# EAGLE design ultrasonic (EAGLE 9.3.2)
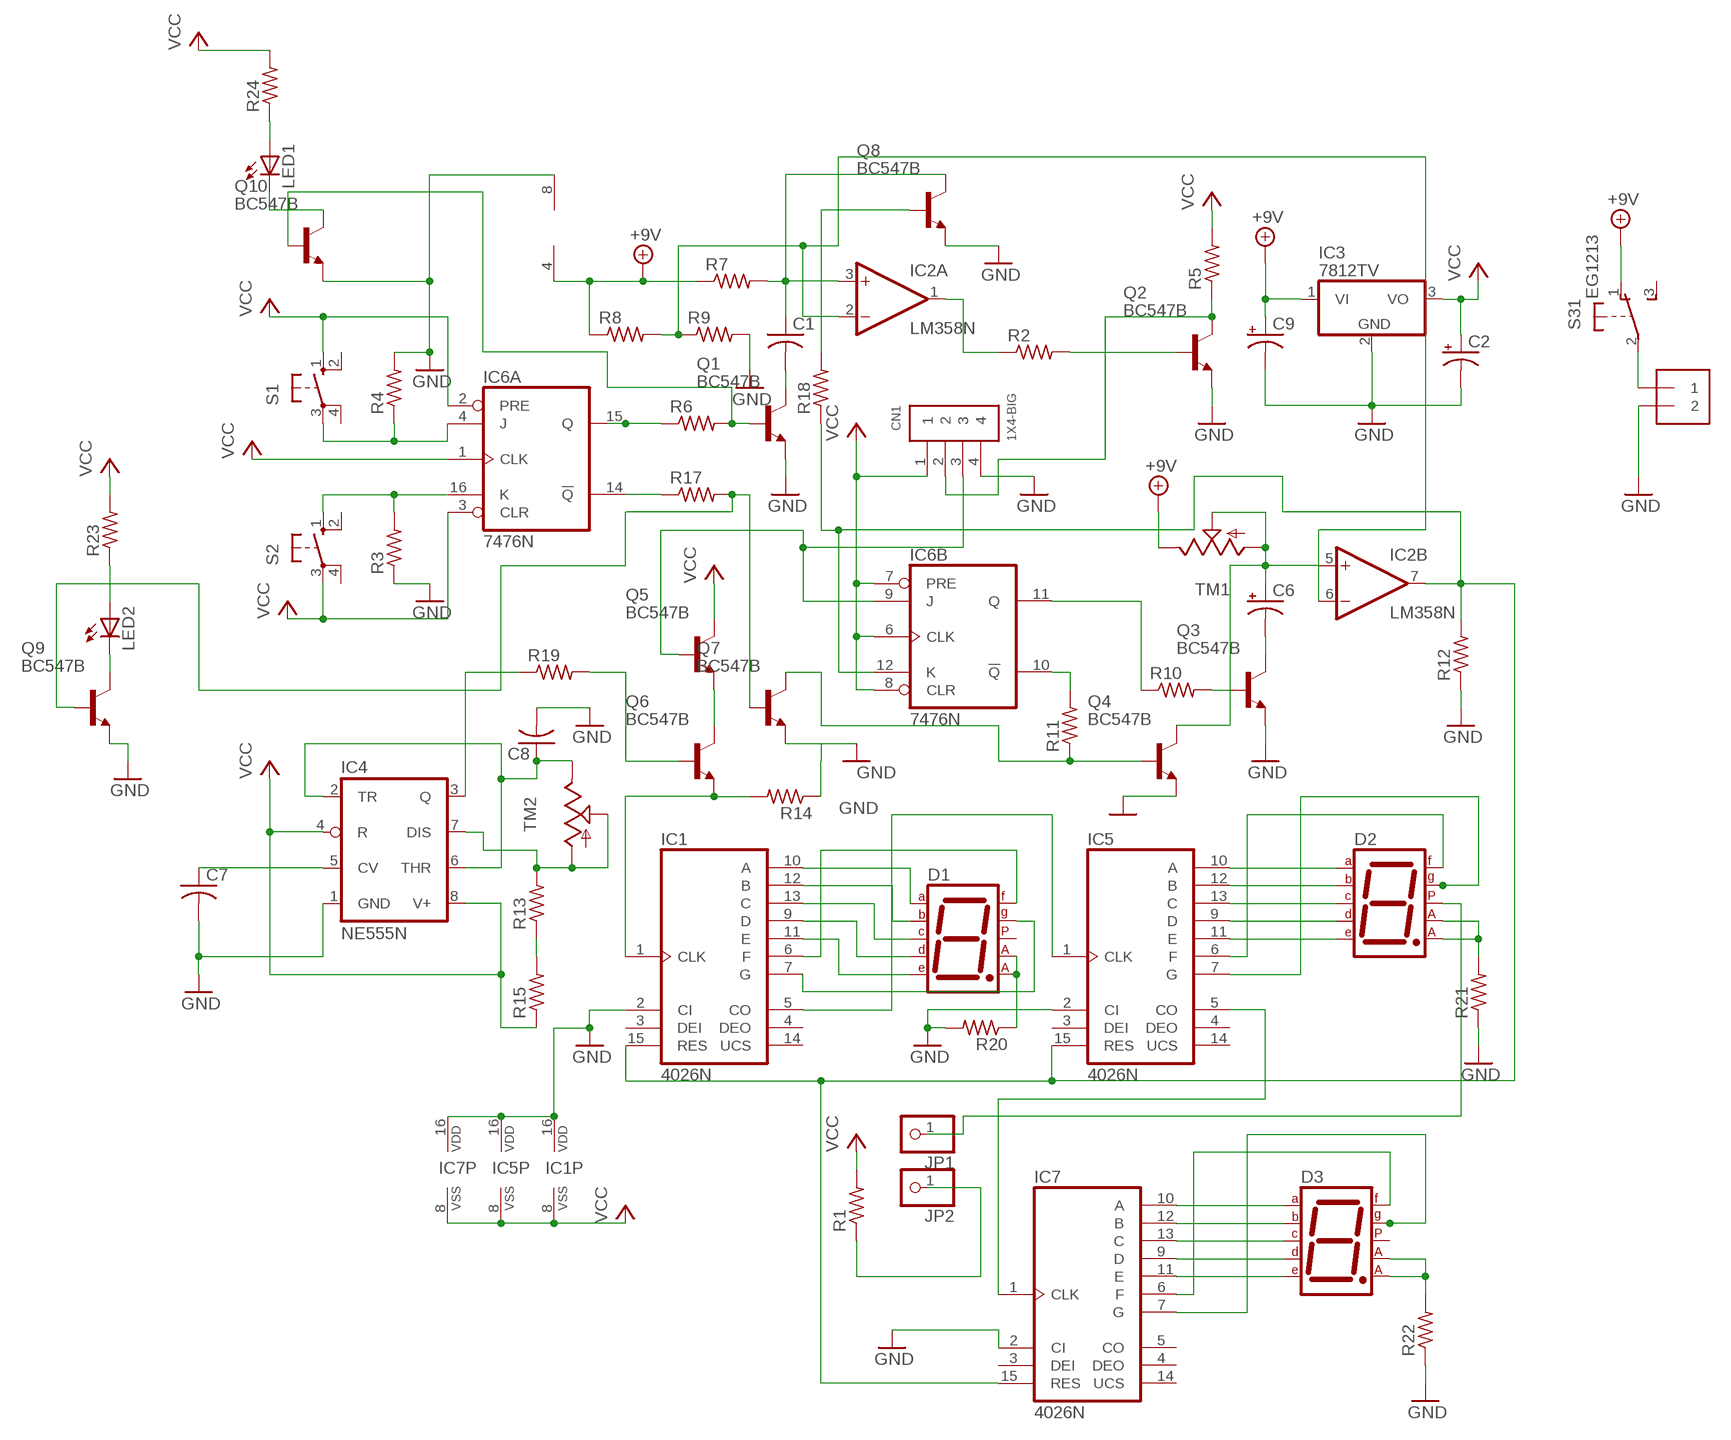
[diagram p0: schematic, sheet 1]

## Parts
C1  C-US025-040X050  [C025-040X050]
C2  CPOL-USE2-4  [E2-4]
C6  CPOL-USE2.5-6  [E2,5-6]
C7  C-US025-040X050  [C025-040X050]
C8  C-US025-040X050  [C025-040X050]
C9  CPOL-USE2.5-6  [E2,5-6]
CN1  1X4-BIG  [1X04-BIG]
D1  7SEG-CA  [7SEG-13]
D2  7SEG-CA  [7SEG-13]
D3  7SEG-CA  [7SEG-13]
IC1  4026N  [DIL16]
IC2  LM358N  [DIL08]
IC3  7812TV  [TO220V]
IC4  NE555N  [DIL08-ROUND]
IC5  4026N  [DIL16]
IC6  7476N  [DIL16]
IC7  4026N  [DIL16]
J1  1X2-3.5MM  [1X2-3.5MM]
JP1  PINHD-1X1  [1X01]
JP2  PINHD-1X1  [1X01]
LED1  LED5MM  [LED5MM]
LED2  LED5MM  [LED5MM]
Q1  BC547B  [TO92]
Q2  BC547B  [TO92]
Q3  BC547B  [TO92]
Q4  BC547B  [TO92]
Q5  BC547B  [TO92]
Q6  BC547B  [TO92]
Q7  BC547B  [TO92]
Q8  BC547B  [TO92]
Q9  BC547B  [TO92]
Q10  BC547B  [TO92]
R1  R-US_0204/7  [0204/7]
R2  R-US_0204/7  [0204/7]
R3  R-US_0204/7  [0204/7]
R4  R-US_0204/7  [0204/7]
R5  R-US_0204/7  [0204/7]
R6  R-US_0204/7  [0204/7]
R7  R-US_0204/7  [0204/7]
R8  R-US_0204/7  [0204/7]
R9  R-US_0204/7  [0204/7]
R10  R-US_0204/7  [0204/7]
R11  R-US_0204/7  [0204/7]
R12  R-US_0204/7  [0204/7]
R13  R-US_0204/7  [0204/7]
R14  R-US_0204/7  [0204/7]
R15  R-US_0204/7  [0204/7]
R17  R-US_0204/7  [0204/7]
R18  R-US_0204/7  [0204/7]
R19  R-US_0204/7  [0204/7]
R20  R-US_0204/7  [0204/7]
R21  R-US_0204/7  [0204/7]
R22  R-US_0204/7  [0204/7]
R23  R-US_0204/7  [0204/7]
R24  R-US_0204/7  [0204/7]
S1  10-XX  [B3F-10XX]
S2  10-XX  [B3F-10XX]
S3  EG1213  [EG1213]
TM1  TRIM  [6MM]
TM2  TRIM  [6MM]

## Nets
+9V: C9.+ IC2.4(P:V-) IC3.1(VI) R7.1 R8.1 S3.1(1:O) TM1.E
GND: C2.- C7.2 C8.2 C9.- CN1.4 IC1.2(CI) IC1.16(VDD) IC2.8(P:V+) IC3.2(GND) IC4.1(GND) IC5.2(CI) IC5.16(VDD) IC7.2(CI) IC7.16(VDD) J1.2 Q1.1(E) Q2.1(E) Q3.1(E) Q4.1(E) Q7.1(E) Q8.1(E) Q9.1(E) Q10.1(E) R3.1 R4.2 R9.2 R12.1 R14.1 R20.2 R21.1 R22.1
N$1: IC2.1(A:OUT) R2.1
N$2: C1.2 Q1.3(C)
N$3: IC6.16(A:K) R3.2 S2.1(S)
N$4: IC6.4(A:J) R4.1 S1.3(P)
N$5: IC4.3(Q) R19.1
N$6: C1.1 IC2.3(A:+IN) Q8.3(C) R7.2
N$8: Q1.2(B) Q10.2(B) R6.2
N$9: IC6.14(A:!Q) R17.1
N$10: CN1.2 Q2.3(C) R5.1
N$11: IC2.2(A:-IN) IC2.6(B:-IN) R8.2 R9.1
N$12: Q2.2(B) R2.2
N$13: Q6.2(B) R19.2
N$14: IC1.15(RES) IC2.7(B:OUT) IC5.15(RES) IC6.12(B:K) IC7.15(RES) R12.2 R18.1
N$15: C7.1 IC4.5(CV)
N$16: CN1.3 IC6.9(B:J) Q5.2(B)
N$17: C6.+ IC2.5(B:+IN) Q4.3(C) TM1.A TM1.S
N$18: C6.- Q3.3(C)
N$19: IC6.11(B:Q) R10.1
N$20: Q3.2(B) R10.2
N$21: IC6.10(B:!Q) R11.2
N$22: Q4.2(B) Q7.3(C) R11.1
N$23: D1.7(A) IC1.10(A)
N$24: D1.3(CA1) D1.8(CA2) R20.1
N$25: Q5.1(E) Q6.3(C)
N$26: JP2.1 R1.1
N$27: D1.6(B) IC1.12(B)
N$28: C8.1 IC4.2(TR) IC4.6(THR) TM2.E
N$29: D1.2(D) IC1.9(D)
N$30: D1.4(C) IC1.13(C)
N$31: IC1.1(CLK) Q6.1(E) R14.2
N$32: D1.1(E) IC1.11(E)
N$33: D1.9(F) IC1.6(F)
N$34: D1.10(G) IC1.7(G)
N$35: IC1.5(CO) IC5.1(CLK)
N$36: D2.3(CA1) D2.8(CA2) R21.2
N$37: D2.7(A) IC5.10(A)
N$38: D2.6(B) IC5.12(B)
N$39: D2.4(C) IC5.13(C)
N$40: D2.2(D) IC5.9(D)
N$41: D2.1(E) IC5.11(E)
N$42: D2.9(F) IC5.6(F)
N$43: R13.1 R15.2
N$44: IC4.7(DIS) R13.2 TM2.A TM2.S
N$45: D2.10(G) IC5.7(G)
N$46: Q7.2(B) Q9.2(B) R17.2
N$47: IC6.15(A:Q) R6.1
N$48: IC5.5(CO) IC7.1(CLK)
N$49: Q8.2(B) R18.2
N$50: J1.1 S3.2(1:P)
N$51: D2.5(DP) JP1.1
N$52: D3.7(A) IC7.10(A)
N$53: D3.6(B) IC7.12(B)
N$54: D3.4(C) IC7.13(C)
N$55: D3.2(D) IC7.9(D)
N$56: D3.1(E) IC7.11(E)
N$57: D3.9(F) IC7.6(F)
N$58: D3.10(G) IC7.7(G)
N$59: D3.3(CA1) D3.8(CA2) R22.2
N$60: LED2.A R23.1
N$61: LED2.K(C) Q9.3(C)
N$64: LED1.K(C) Q10.3(C)
N$65: LED1.A R24.1
VCC: C2.+ CN1.1 IC1.8(VSS) IC3.3(VO) IC4.4(R) IC4.8(V+) IC5.8(VSS) IC6.1(A:CLK) IC6.2(A:PRE) IC6.3(A:CLR) IC6.6(B:CLK) IC6.7(B:PRE) IC6.8(B:CLR) IC7.8(VSS) Q5.3(C) R1.2 R5.2 R15.1 R23.2 R24.2 S1.1(S) S2.3(P)
Unconnected: D1.5(DP) D3.5(DP) IC1.3(DEI) IC1.4(DEO) IC1.14(UCS) IC5.3(DEI) IC5.4(DEO) IC5.14(UCS) IC7.3(DEI) IC7.4(DEO) IC7.5(CO) IC7.14(UCS) S1.2(S1) S1.4(P1) S2.2(S1) S2.4(P1) S3.3(1:S) S3.MT1(MT) S3.MT2(MT)

## Power pins joined to a net without a drawn wire
GND: IC6.13(P:GND)
VCC: IC6.5(P:VCC)

## Library data of the parts
C1 C7 C8 = adafruit:C-US: CAPACITOR, American symbol
C2 C6 C9 = adafruit:CPOL-US: POLARIZED CAPACITOR, American symbol
CN1 = adafruit:1X4: 4-pin connector
D1-D3 = special:7SEG-CA: 7-segment DISPLAY single anode, 13 mm
IC1 IC5 IC7 = 40xx:4026: Decade COUNTER/DIVIDER, 7-seg. outputs
IC2 = linear:LM358: OP AMP also LM158; LM258; LM2904 Source: http://cache.national.com/ds/LM/LM158.pdf
IC3 = linear:78*: Positive VOLTAGE REGULATOR Source: http://cache.national.com/ds/LM/LM78L05.pdf http://www.fairchildsemi.com/ds/LM/LM7805.pdf
IC4 = adafruit:*555: TIMER Changed DIP package to have round (not oval) pin pads http://www.ladyada.net/library/pcb/eaglelibrary.html
IC6 = 74xx-us:74*76: Dual J-K FLIP FLOP, preset and clear
J1 = adafruit:1X2: 3.5mm Terminal block http://www.ladyada.net/library/pcb/eaglelibrary.html
JP1 JP2 = adafruit:PINHD-1X1: Pin header 1x1 for 0.1" spacing With round pins
LED1 LED2 = adafruit:LED: LED OSRAM: - CHIPLED LG R971, LG N971, LY N971, LG Q971, LY Q971, LO R971, LY R971 LH N974, LH R974 LS Q976, LO Q976, LY Q976 LO Q996 - Hyper CHIPLED LW Q18S LB Q993, LB Q99A, LB R99A - SideLED LS A670, LO A670, LY A670, LG A670, LP A670 LB A673, LV A673, LT A673, LW A673 LH A674 LY A675 LS A676, LA A676, LO A676, LY A676, LW A676 LS A679, LY A679, LG A679 - Hyper Micro SIDELED® LS Y876, LA Y876, LO Y876, LY Y876 LT Y87S - SmartLED LW L88C, LW L88S LB L89C, LB L89S, LG L890 LS L89K, LO L89K, LY L89K LS L896, LA L896, LO L896, LY L896 - TOPLED LS T670, LO T670, LY T670, LG T670, LP T670 LSG T670, LSP T670, LSY T670, LOP T670, LYG T670 LG T671, LOG T671, LSG T671 LB T673, LV T673, LT T673, LW T673 LH T674 LS T676, LA T676, LO T676, LY T676, LB T676, LH T676, LSB T676, LW T676 LB T67C, LV T67C, LT T67C, LS T67K, LO T67K, LY T67K, LW E67C LS E67B, LA E67B, LO E67B, LY E67B, LB E67C, LV E67C, LT E67C LW T67C LS T679, LY T679, LG T679 LS T770, LO T770, LY T770, LG T770, LP T770 LB T773, LV T773, LT T773, LW T773 LH T774 LS E675, LA E675, LY E675, LS T675 LS T776, LA T776, LO T776, LY T776, LB T776 LHGB T686 LT T68C, LB T68C - Hyper Mini TOPLED® LB M676 - Mini TOPLED Santana® LG M470 LS M47K, LO M47K, LY M47K Source: http://www.osram.convergy.de/
Q1-Q10 = transistor-npn:BC547*: NPN Transistor
R1-R15 R17-R24 = adafruit:R-US_: RESISTOR, American symbol
S1 S2 = switch-omron:10-XX: OMRON SWITCH; MPN: B3F-1000; OC_FARNELL: 176432; OC_NEWARK: 36M3542
S3 = adafruit:EG1213: E-Switch right-angle slide SPDT Part #EG1213 http://www.ladyada.net/library/eagle
TM1 TM2 = adafruit:TRIM

## Board
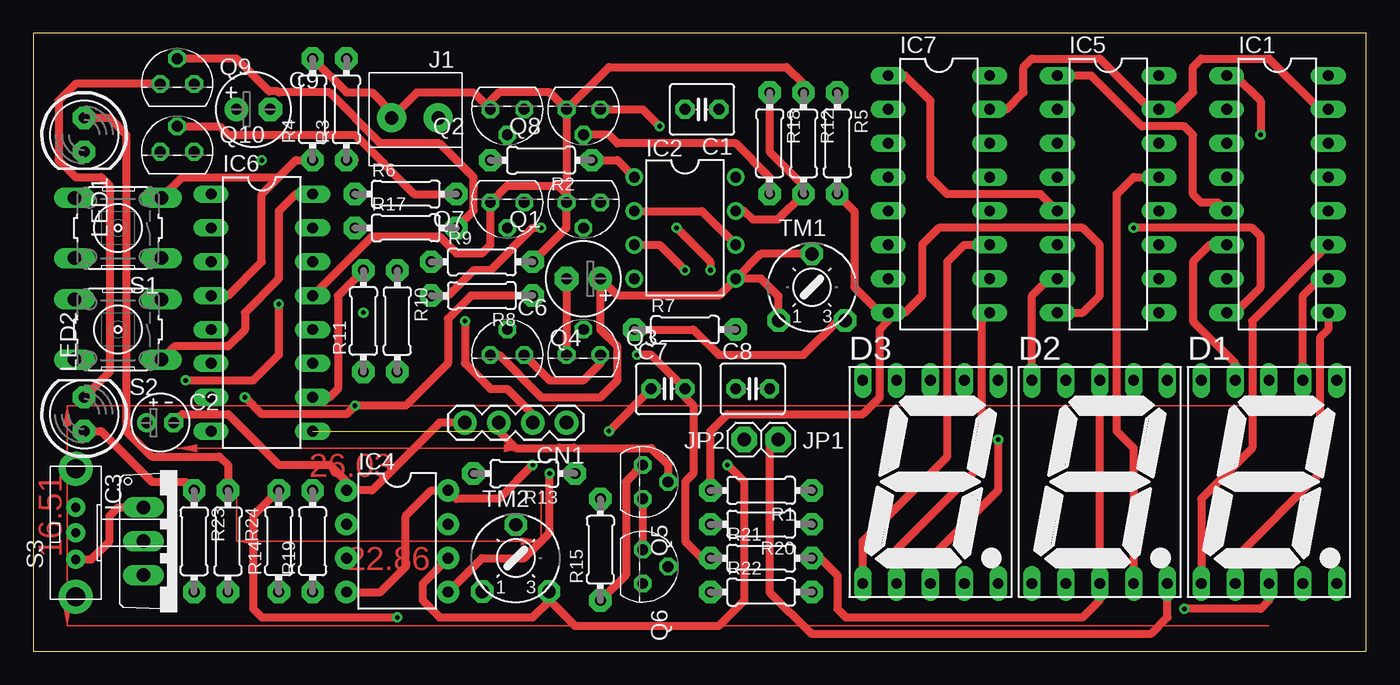
[diagram p1: board, top side]
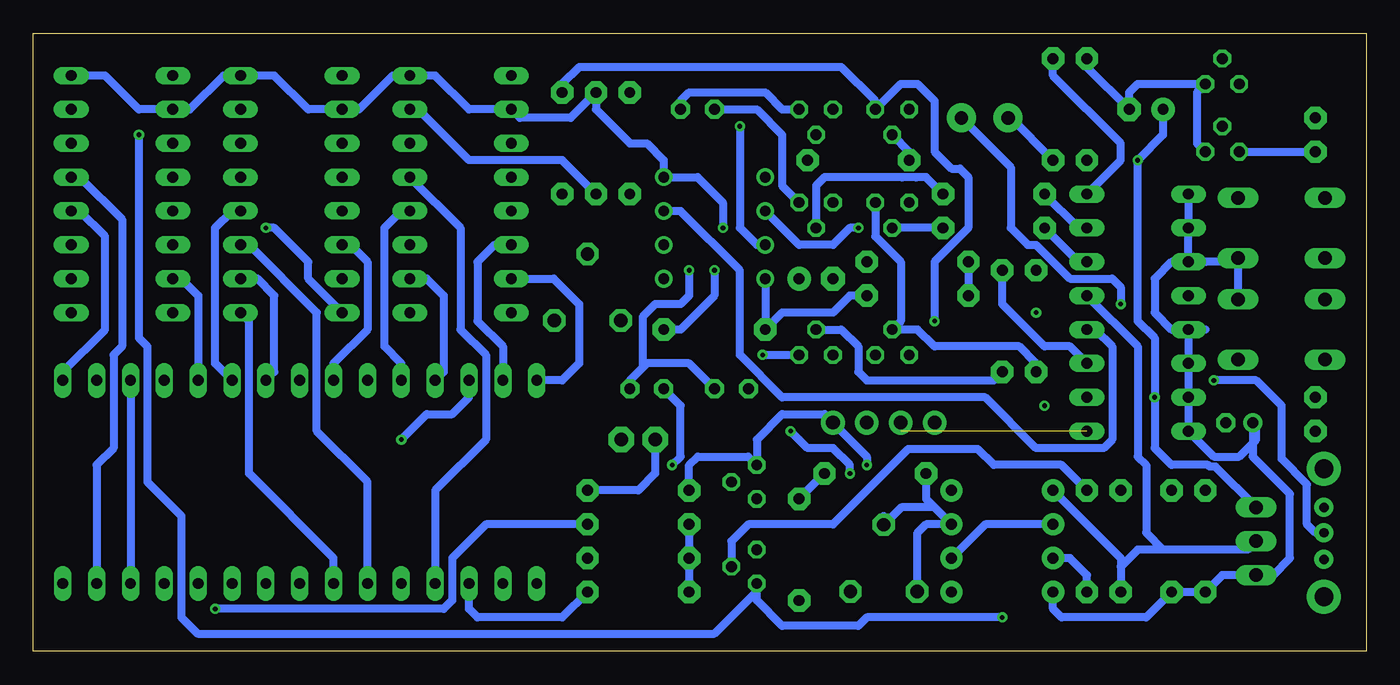
[diagram p2: board, bottom side, seen from below]

Size 100 x 46.34 mm. Coordinates in mm from the lower left corner, seen from the top.
Outline: 0,0 100,0 100,46.34 0,46.34 0,0
Copper layers (1*16): Top 0.035mm / dielectric 1.5mm / Bottom 0.035mm
Design rules "default": minimum track width 6mil, minimum drill 0.35mm, track to track 6mil, track to pad 6mil, pad to pad 6mil, via to via 6mil, smd to smd 6mil, copper to edge 40mil, drill to drill 6mil, minimum pad ring 10mil, minimum via ring 8mil, stop-mask expansion 4mil, vias tented up to drill 0mil, thermal gap 10mil

### Footprints (pad centres in the part's own frame; a part is rotated, then mirrored left to right if it is on the bottom)
C025-040X050 = drill 0.813 pad 1.422 octagon: 1 -1.27,0; 2 1.27,0
E2-4 = drill 0.813 pad 1.422: + -1.016,0 | drill 0.813 pad 1.422 octagon: - 1.016,0
E2,5-6 = drill 0.813 pad 1.778: + -1.27,0 | drill 0.813 pad 1.778 octagon: - 1.27,0
1X04-BIG = drill 1.016 pad 1.778: 1 0,0; 2 2.54,0; 3 5.08,0; 4 7.62,0
7SEG-13 = drill 0.813 long: 1 -5.08,-7.62; 2 -2.54,-7.62; 3 0,-7.62; 4 2.54,-7.62; 5 5.08,-7.62; 6 5.08,7.62; 7 2.54,7.62; 8 0,7.62; 9 -2.54,7.62; 10 -5.08,7.62
DIL16 = drill 0.813 long: 1 -8.89,-3.81; 2 -6.35,-3.81; 3 -3.81,-3.81; 4 -1.27,-3.81; 5 1.27,-3.81; 6 3.81,-3.81; 7 6.35,-3.81; 8 8.89,-3.81; 9 8.89,3.81; 10 6.35,3.81; 11 3.81,3.81; 12 1.27,3.81; 13 -1.27,3.81; 14 -3.81,3.81; 15 -6.35,3.81; 16 -8.89,3.81
DIL08 = drill 0.813 pad 1.27: 1 -3.81,-3.81; 2 -1.27,-3.81; 3 1.27,-3.81; 4 3.81,-3.81; 5 3.81,3.81; 6 1.27,3.81; 7 -1.27,3.81; 8 -3.81,3.81
TO220V = drill 1.016 long: 1 -2.54,-2.54; 2 0,-2.54; 3 2.54,-2.54
DIL08-ROUND = drill 0.813 pad 1.676: 1 -3.81,-3.81; 2 -1.27,-3.81; 3 1.27,-3.81; 4 3.81,-3.81; 5 3.81,3.81; 6 1.27,3.81; 7 -1.27,3.81; 8 -3.81,3.81
1X2-3.5MM = drill 1 pad 2.184: 1 1.8,0; 2 -1.7,0
1X01 = drill 1.016 pad 1.93 octagon: 1 0,0
LED5MM = drill 0.813 pad 1.676 octagon: A -1.27,0; K 1.27,0
TO92 = drill 0.813 octagon: 1 1.27,0; 2 0,1.905; 3 -1.27,0
0204/7 = drill 0.813 pad 1.676 octagon: 1 -3.81,0; 2 3.81,0
B3F-10XX = drill 1.016 long: 1 -3.251,2.261; 2 3.251,2.261; 3 -3.251,-2.261; 4 3.251,-2.261
EG1213 = drill 0.7 pad 1.422: 1 -2,0; 2 0,0; 3 1.9,0 | drill 1.4 pad 2.54: MT1 -4.8,0; MT2 4.8,0
6MM = drill 1 pad 1.676 octagon: A -2.5,-2.5; E 2.5,-2.5; S 0,2.5

### Placement (x,y rotation side)
C1  50.16,40.64 180 top
C2  9.53,17.15 0 top
C6  41.27,27.94 180 top
C7  47.62,19.69 0 top
C8  53.98,19.69 0 top
C9  16.51,40.64 0 top
CN1  40.01,17.15 180 top
D1  92.71,12.7 0 top
D2  80.01,12.7 0 top
D3  67.31,12.7 0 top
IC1  93.34,34.29 270 top
IC2  48.9,31.75 270 top
IC3  10.79,8.26 270 top
IC4  27.3,8.26 270 top
IC5  80.64,34.29 270 top
IC6  17.14,25.4 270 top
IC7  67.94,34.29 270 top
J1  28.57,40.01 0 top
JP1  55.88,15.88 0 top
JP2  53.34,15.88 0 top
LED1  3.81,38.73 270 top
LED2  3.81,17.78 90 top
Q1  41.27,33.66 180 top
Q2  35.56,40.64 180 top
Q3  41.27,22.23 0 top
Q4  35.56,22.23 0 top
Q5  45.72,12.7 270 top
Q6  45.72,6.35 270 top
Q7  35.56,33.66 180 top
Q8  41.27,40.64 180 top
Q9  10.79,42.55 0 top
Q10  10.79,37.47 0 top
R1  54.61,12.07 180 top
R2  38.1,36.83 180 top
R3  23.5,40.64 90 top
R4  20.95,40.64 90 top
R5  60.33,38.1 270 top
R6  27.94,34.29 0 top
R7  48.9,24.13 0 top
R8  33.66,26.67 180 top
R9  33.66,29.21 0 top
R10  27.3,24.77 270 top
R11  24.77,24.77 90 top
R12  57.78,38.1 270 top
R13  36.83,13.34 180 top
R14  18.41,8.26 90 top
R15  42.55,7.62 90 top
R17  27.94,31.75 0 top
R18  55.24,38.1 270 top
R19  20.95,8.26 90 top
R20  54.61,9.53 180 top
R21  54.61,6.98 0 top
R22  54.61,4.45 0 top
R23  12.06,8.26 270 top
R24  14.61,8.26 270 top
S1  6.35,31.75 180 top
S2  6.35,24.13 180 top
S3  3.17,8.89 90 top
TM1  58.42,27.3 0 top
TM2  36.2,6.98 0 top

### Tracks (layer width: path | path; a pad name or v marks a point on that pad's centre or on a via)
+9V  (via drill 0.35)
  Top 0.61: R7.1 49.53,24.13 51.44,22.23 57.78,22.23 60.37,24.8 TM1.E | S3.1 4.35,6.89 5.71,8.26 5.71,10.16 6.35,10.8 IC3.1 | R8.1 32.83,26.67 31.11,24.96 31.11,21.59 27.94,18.42 v24.13,18.42 23.5,17.78 17.14,17.78 v15.88,19.05
  Bottom 0.61: IC2.4 R7.1 43.81,25.4 40.01,25.4 38.73,26.67 R8.1 | IC3.1 11.3,13.84 11.75,13.84 11.87,13.97 14.61,13.97 15.88,15.24 v15.88,19.05 15.88,23.5 17.14,24.77 v17.14,36.83 15.24,38.73 C9.+
GND  (via drill 0.35)
  Top 0.61: IC6.13 25.4,31.12 30.48,31.12 31.75,29.84 33.66,29.84 34.29,30.48 Q7.1 35.56,34.92 39.37,34.92 40.01,34.29 Q1.1 | Q4.1 38.73,20.32 41.27,20.32 42.55,21.59 Q3.1 | Q8.1 Q1.1 | Q8.1 38.73,41.91 34.92,41.91 34.29,41.28 Q2.1 33.02,41.91 28.78,41.91 J1.2 26.88,40.44 25.4,41.91 23.5,41.91 R4.2 | Q8.1 43.18,43.81 56.52,43.81 57.78,42.55 R12.1 | R9.2 40.01,31.75 Q1.1 | R3.1 24.13,36.83 | R21.1 50.16,6.98 48.9,8.26 48.9,12.7 49.53,13.34 49.53,18.42 48.9,19.05 C7.2 46.35,22.23 v45.28,22.23 | CN1.4 30.48,17.15 25.4,12.07 IC4.1 23.5,12.7 22.23,13.97 18.41,13.97 14.61,17.78 11.18,17.78 C2.- | v48.26,31.75 50.8,29.21 v50.8,28.58
  Bottom 0.61: R4.2 20.95,43.81 C9.- 17.78,41.91 17.14,42.55 Q9.1 12.7,41.91 12.7,38.1 Q10.1 | R3.1 26.67,40.01 J1.2 | IC3.2 8.89,7.62 15.24,7.62 | 15.24,7.62 17.14,7.62 18.41,6.35 | 18.41,6.35 R14.1 | R20.2 R21.1 R22.1 | IC1.16 94.61,43.18 92.08,40.64 IC1.2 88.27,40.64 85.72,43.18 IC5.16 81.92,43.18 79.38,40.64 IC5.2 75.56,40.64 73.03,43.18 IC7.16 69.85,43.18 67.31,40.64 IC7.2 63.5,40.01 59.69,40.01 R12.1 57.78,40.64 55.24,38.1 53.98,38.1 52.7,36.83 IC2.8 50.16,35.56 48.26,33.66 v48.26,31.75 | C7.2 50.8,21.59 53.98,21.59 54.29,21.27 | 54.29,21.27 55.24,20.32 C8.2 | v45.28,22.23 Q3.1 | IC4.1 18.41,6.98 18.41,6.35 | IC6.13 17.14,22.86 17.14,14.61 16.51,13.97 16.51,8.89 15.24,7.62 | v50.8,28.58 50.8,26.67 51.44,26.04 53.34,26.04 54.29,25.08 54.29,21.27
N$1
  Top 0.61: R2.1 43.81,36.83 IC2.1
N$2
  Bottom 0.61: C1.2 45.72,40.64 43.81,38.73 43.81,34.92 Q1.3
N$3
  Top 0.61: S2.1 10.59,22.86 14.61,22.86 15.88,24.13 15.88,25.4 18.41,27.94 18.41,33.02 19.68,34.29 IC6.16
  Bottom 0.61: IC6.16 18.41,36.83 18.41,38.1 23.5,43.18 R3.2
N$4
  Top 0.61: IC6.4 14.61,26.67 17.14,29.21 17.14,34.29 18.41,35.56 | 18.41,35.56 19.68,36.83 R4.1 | S1.3 11.15,35.56 18.41,35.56
N$5
  Bottom 0.61: R19.1 20.95,5.72 22.23,6.98 IC4.3
N$6  (via drill 0.35)
  Top 0.61: IC2.3 46.99,30.48 v48.9,28.58 | Q8.3 45.72,40.64 v46.99,39.37
  Bottom 0.61: v48.9,28.58 48.9,26.67 51.44,24.13 R7.2 | C1.1 51.44,41.28 50.8,41.91 45.09,41.91 43.81,40.64 Q8.3 | v46.99,39.37 46.99,31.75 45.72,30.48 IC2.3
N$7  (via drill 0.35)
  other vias: 24.77,25.4
N$8
  Top 0.61: Q10.2 13.97,39.37 14.61,38.73 24.13,38.73 28.57,34.29 R6.2
  Bottom 0.61: R6.2 33.02,35.56 33.73,35.56 33.75,35.53 34.83,35.53 34.85,35.56 40.64,35.56 41.27,34.92 Q1.2
N$9
  Bottom 0.61: IC6.14 21.59,29.21 R17.1
N$10  (via drill 0.35)
  Top 0.61: v32.38,24.77 32.38,21.59 34.29,19.69 35.56,19.69 37.47,17.78 CN1.2
  Bottom 0.61: R5.1 60.33,42.55 59.05,43.81 39.37,43.81 36.83,41.28 Q2.3 34.92,42.55 33.66,42.55 32.38,41.28 32.38,37.47 31.11,36.2 30.48,36.2 29.84,35.56 29.84,31.75 32.38,29.21 v32.38,24.77
N$11  (via drill 0.35)
  Top 0.61: IC2.2 50.16,33.02 IC2.6 | R8.2 31.11,26.67 33.02,28.58 34.29,28.58 37.47,31.75 v38.1,31.75
  Bottom 0.61: R9.1 R8.2 | v38.1,31.75 38.73,31.75 40.01,30.48 42.55,30.48 IC2.2
N$12
  Bottom 0.61: Q2.2 34.29,37.47 R2.2
N$13
  Bottom 0.61: R19.2 22.86,13.97 27.94,13.97 29.13,15.16 34.37,15.16 40.01,9.53 46.35,9.53 47.62,8.26 Q6.2
N$14
  Top 0.61: IC2.7 53.34,33.02 53.98,32.39 55.88,32.39 R12.2 57.78,34.92 55.24,37.47 R18.1 | IC7.15 73.03,40.64 74.3,41.91 74.3,43.81 74.93,44.45 80.01,44.45 83.82,40.64 IC5.15 85.72,40.64 87,41.91 87,43.81 87.63,44.45 92.71,44.45 96.52,40.64 IC1.15
  Bottom 0.61: IC2.7 51.44,33.02 46.99,28.58 46.99,22.23 43.81,19.05 28.57,19.05 24.77,15.24 19.68,15.24 19.05,15.88 19.05,22.86 20.32,24.13 IC6.12 | R12.2 60.33,36.83 67.31,36.83 71.12,40.64 IC7.15
N$15  (via drill 0.35)
  Top 0.61: C7.1 v43.18,16.51 | IC4.5 33.66,6.98 36.83,6.98 38.73,8.89 v38.73,13.34
  Bottom 0.61: 42.55,15.88 v43.18,16.51 41.91,15.24 40.01,15.24 38.73,13.97 v38.73,13.34
N$16  (1 unrouted)
  Top 0.61: CN1.3 34.92,16.51 36.2,15.24 39.44,15.24 39.47,15.27 40.54,15.27 40.57,15.24 46.35,15.24 47.62,13.97 Q5.2
N$17
  Top 0.61: TM1.A 55.92,26.63 54.61,27.94 IC2.5 | TM1.S 54.57,29.81 IC2.5 | Q4.3 34.92,22.23 38.1,19.05 42.55,19.05 43.81,20.32 43.81,22.86 42.55,24.13 C6.+ 43.81,26.67 51.44,26.67 IC2.5
N$18
  Top 0.61: C6.- Q3.3
N$19
  Bottom 0.61: IC6.11 22.23,22.86 24.13,22.86 27.3,26.04 R10.1
N$20
  Bottom 0.61: Q3.2 39.37,24.13 38.1,22.86 38.1,20.96 37.47,20.32 27.94,20.32 R10.2
N$21
  Top 0.61: R11.2 22.86,26.67 22.86,19.69 22.23,19.05 IC6.10
N$22
  Bottom 0.61: R11.1 24.77,21.59 26.04,22.86 32.38,22.86 33.66,24.13 Q4.2 34.92,24.77 34.92,29.21 36.83,31.12 Q7.3
N$23
  Top 0.61: D1.7 95.25,26.67 96.52,27.94 IC1.10
N$24  (via drill 0.35)
  Top 0.61: D1.3 92.71,3.81 92.08,3.18 v86.36,3.18
  Bottom 0.61: D1.8 D1.3 | R20.1 66.04,9.53 68.58,6.98 68.58,3.81 69.22,3.18 v86.36,3.18
N$25
  Top 0.61: Q5.1 Q6.3
N$26
  Bottom 0.61: JP2.1 53.34,13.34 54.61,12.07 R1.1
N$27
  Bottom 0.61: D1.6 97.79,20.96 94.61,24.13 94.61,31.12 96.52,33.02 IC1.12
N$28  (via drill 0.35)
  Top 0.61: TM2.E 38.7,3.85 | 38.7,3.85 40.64,1.91 51.44,1.91 53.34,3.81 53.34,12.7 v52.07,13.97 | IC4.6 29.21,5.08 29.21,3.81 30.48,2.54 37.47,2.54 38.7,3.77 38.7,3.85
  Bottom 0.61: IC4.6 28.57,9.53 IC4.2 | v52.07,13.97 51.44,14.61 51.44,18.42 C8.1
N$29
  Top 0.61: IC1.9 97.16,24.13 96.52,23.5 96.52,13.34 90.17,6.98 D1.2
N$30
  Bottom 0.61: IC1.13 96.52,35.56 93.34,32.39 93.34,22.86 93.98,22.23 93.98,15.24 95.25,13.97 D1.4
N$31  (via drill 0.35)
  Top 0.61: IC1.1 90.17,43.18 92.08,41.28 v92.08,38.73 | R14.2 16.51,10.16 16.51,3.18 17.14,2.54 v27.3,2.54
  Bottom 0.61: v92.08,38.73 92.08,23.5 91.44,22.86 91.44,12.7 88.9,10.16 88.9,2.54 87.68,1.32 48.9,1.32 45.72,4.5 Q6.1 45.72,3.81 43.81,1.91 38.1,1.91 37.47,2.54 v27.3,2.54
N$32
  Top 0.61: IC1.11 91.44,24.77 91.44,15.24 87.63,11.43 D1.1
N$33
  Top 0.61: IC1.6 88.27,30.48 87,29.21 87,24.77 90.17,21.59 D1.9
N$34
  Bottom 0.61: IC1.7 88.9,27.94 87.63,26.67 D1.10
N$35
  Top 0.61: IC1.5 88.9,33.66 87.63,33.66 87,34.29 87,38.73 86.36,39.37 83.19,39.37 79.38,43.18 IC5.1
N$36
  Top 0.61: D2.8 D2.3 80.01,3.81 78.74,2.54 60.96,2.54 60.33,3.18 60.33,5.72 59.05,6.98 R21.2
N$37
  Bottom 0.61: D2.7 81.92,20.96 81.92,26.67 83.19,27.94 IC5.10
N$38
  Bottom 0.61: D2.6 86.36,21.59 86.36,31.75 85.09,33.02 IC5.12
N$39
  Top 0.61: D2.4 82.55,15.24 81.28,16.51 81.28,34.29 82.55,35.56 IC5.13
N$40
  Bottom 0.61: D2.2 77.47,6.98 83.82,13.34 83.82,24.77 IC5.9
N$41
  Bottom 0.61: IC5.11 83.82,30.48 78.74,25.4 78.74,16.51 74.93,12.7 D2.1
N$42
  Bottom 0.61: IC5.6 76.2,30.48 74.93,29.21 74.93,24.13 77.47,21.59 D2.9
N$43
  Bottom 0.61: R15.2 R13.1
N$44
  Bottom 0.61: 36.2,10.16 TM2.S 34.88,10.8 32.38,10.8 | 32.38,10.8 IC4.7 33.02,9.53 33.7,8.85 TM2.A | R13.2 33.02,11.43 32.38,10.8
N$45
  Top 0.61: D2.10 74.93,26.67 76.2,27.94 IC5.7
N$46
  Top 0.61: R17.2 33.05,33.05 33.05,34.83 33.02,34.85 33.02,35.56 30.48,38.1 26.04,38.1 22.23,41.91 18.41,41.91 18.34,41.99 17.7,41.99 15.24,44.45 Q9.2
  Bottom 0.61: R17.2 Q7.2
N$47
  Bottom 0.61: IC6.15 21.59,31.75 R6.1
N$48
  Top 0.61: IC5.5 75.56,34.29 68.58,34.29 67.31,35.56 67.31,41.28 65.41,43.18 IC7.1
N$49
  Top 0.61: R18.2 55.24,35.56 52.7,38.1 43.81,38.1 43.18,38.73 Q8.2
N$50  (via drill 0.35)
  Top 0.61: v18.41,26.04 18.41,22.23 16.51,20.32 v11.43,20.32
  Bottom 0.61: J1.1 26.67,36.3 26.67,31.75 25.4,30.48 24.77,30.48 22.23,27.94 19.05,27.94 18.41,27.3 v18.41,26.04 | S3.2 3.81,8.89 4.45,9.53 4.45,12.52 6.35,14.42 6.35,18.42 8.26,20.32 v11.43,20.32
N$51
  Top 0.61: JP1.1 55.24,15.24 55.24,4.45 58.37,1.32 83.87,1.32 85.09,2.54 D2.5
N$52
  Bottom 0.61: IC7.10 70.48,27.94 69.22,26.67 69.22,20.96 D3.7
N$53
  Bottom 0.61: D3.6 72.39,21.59 73.66,22.86 73.66,31.75 72.39,33.02 IC7.12
N$54
  Bottom 0.61: IC7.13 67.94,31.75 67.94,24.13 66.04,22.23 66.04,15.88 69.85,12.07 D3.4 69.85,4.45
N$55
  Top 0.61: IC7.9 71.12,24.77 71.12,13.97 64.77,7.62 D3.2
N$56
  Top 0.61: D3.1 62.23,8.26 68.58,14.61 68.58,29.21 69.85,30.48 IC7.11
N$57
  Bottom 0.61: IC7.6 65.41,30.48 66.67,29.21 66.67,24.77 64.77,22.86 D3.9
N$58
  Bottom 0.61: IC7.7 60.96,27.94 59.05,26.04 59.05,21.59 60.33,20.32 D3.10
N$59  (via drill 0.35)
  Top 0.61: D3.3 67.31,6.98 72.39,12.07 v72.39,15.88
  Bottom 0.61: R22.2 60.33,2.54 66.67,2.54 67.31,3.18 D3.3 | v72.39,15.88 70.48,17.78 68.58,17.78 67.31,19.05 D3.8
N$60
  Top 0.61: LED2.A 5.08,16.51 8.89,12.7 11.43,12.7 R23.1
N$61
  Top 0.61: Q9.3 3.17,42.55 1.91,41.28 1.91,36.83 3.17,35.56 5.08,35.56 5.71,34.92 5.71,20.96 LED2.K
N$64
  Bottom 0.61: Q10.3 LED1.K
N$65
  Top 0.61: LED1.A 5.71,40.01 6.99,38.73 6.99,16.51 8.89,14.61 13.97,14.61 14.61,13.97 R24.1
VCC  (via drill 0.35)
  Top 0.61: R5.2 61.59,33.02 61.59,27.3 63.5,25.4 IC7.8 | IC5.8 78.74,25.4 80.01,26.67 80.01,30.48 78.74,31.75 67.94,31.75 66.67,30.48 66.67,26.67 65.41,25.4 IC7.8 | IC1.8 90.17,25.4 92.08,27.3 92.08,31.12 91.44,31.75 v82.55,31.75 | R1.2 50.8,16.51 52.07,17.78 62.23,17.78 63.5,19.05 63.5,24.13 64.14,24.77 IC7.8 | Q5.3 44.45,12.7 44.45,5.72 R15.1 | v37.47,13.97 34.92,11.43 31.75,11.43 IC4.8 29.84,12.07 27.94,10.16 27.94,6.35 26.04,4.45 IC4.4
  Bottom 0.61: IC6.3 IC6.2 IC6.1 13.06,34.29 | IC6.5 IC6.6 IC6.7 IC6.8 11.43,14.61 9.53,14.61 8.26,15.88 8.26,16.89 C2.+ 8.51,14.61 5.71,11.81 5.71,6.98 6.99,5.72 IC3.3 10.79,5.72 R23.2 R24.2 16.51,2.54 22.86,2.54 23.5,3.18 IC4.4 | IC6.3 12.06,29.21 | 12.06,24.13 IC6.5 | IC6.3 14.61,29.21 15.88,27.94 15.88,25.4 14.61,24.13 IC6.5 | IC6.3 9.88,29.21 S1.1 S2.3 | IC5.8 79.38,27.94 79.38,29.21 81.92,31.75 v82.55,31.75 | R1.2 50.8,13.97 50.16,14.61 46.35,14.61 Q5.3 45.72,15.88 43.81,17.78 40.64,17.78 CN1.1 37.47,14.61 v37.47,13.97
(copper drawn outside any net)
  shapes: Top area x3